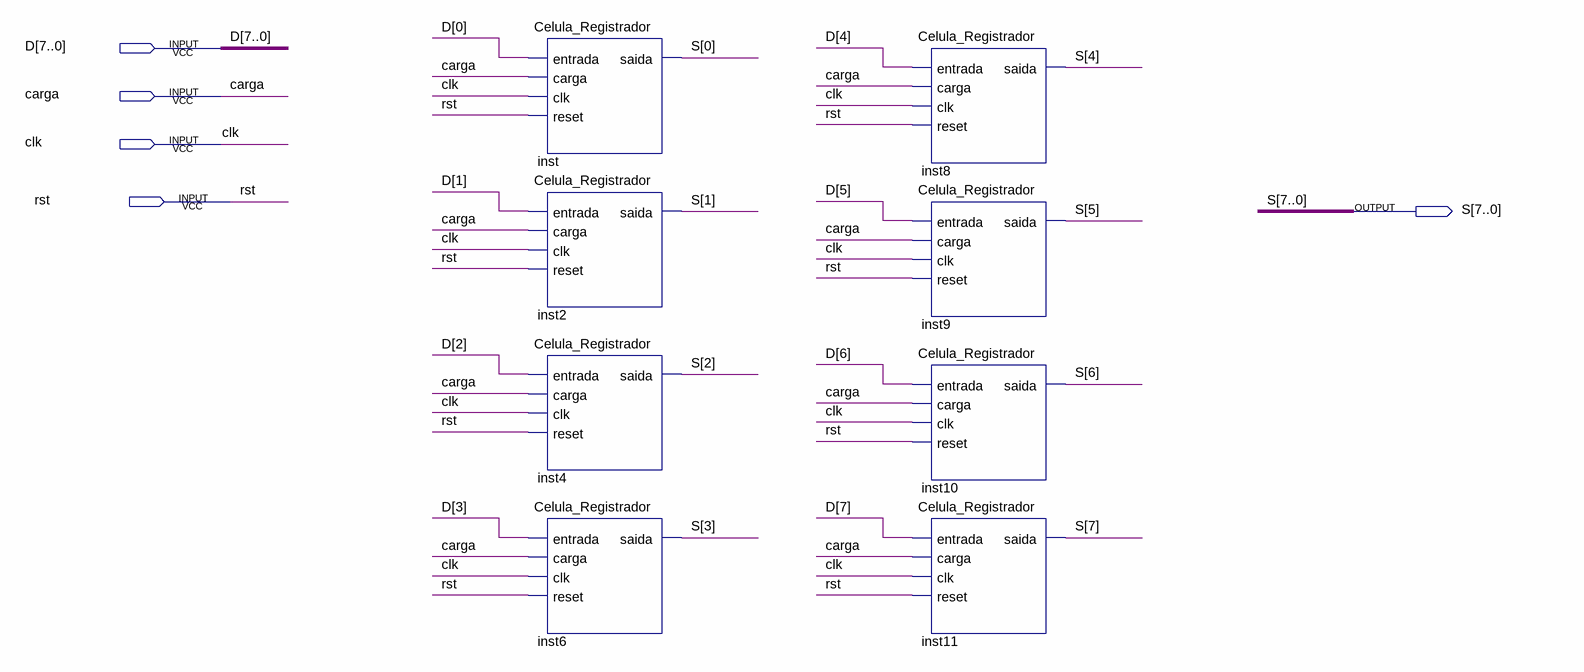
[diagram p0: schematic sheet]
// Quartus schematic Registrador_8b.bdf as structural Verilog: 8 symbols, 5 pins
module Registrador_8b (
  input  [7:0] D,
  input  carga,
  input  clk,
  input  rst,
  output [7:0] S
);

  Celula_Registrador inst (.entrada(D[0]), .carga(carga), .clk(clk), .reset(rst), .saida(S[0]));
  Celula_Registrador inst2 (.entrada(D[1]), .carga(carga), .clk(clk), .reset(rst), .saida(S[1]));
  Celula_Registrador inst4 (.entrada(D[2]), .carga(carga), .clk(clk), .reset(rst), .saida(S[2]));
  Celula_Registrador inst6 (.entrada(D[3]), .carga(carga), .clk(clk), .reset(rst), .saida(S[3]));
  Celula_Registrador inst8 (.entrada(D[4]), .carga(carga), .clk(clk), .reset(rst), .saida(S[4]));
  Celula_Registrador inst9 (.entrada(D[5]), .carga(carga), .clk(clk), .reset(rst), .saida(S[5]));
  Celula_Registrador inst10 (.entrada(D[6]), .carga(carga), .clk(clk), .reset(rst), .saida(S[6]));
  Celula_Registrador inst11 (.entrada(D[7]), .carga(carga), .clk(clk), .reset(rst), .saida(S[7]));
endmodule
